# Altium project BigBossBoard.PrjPcb
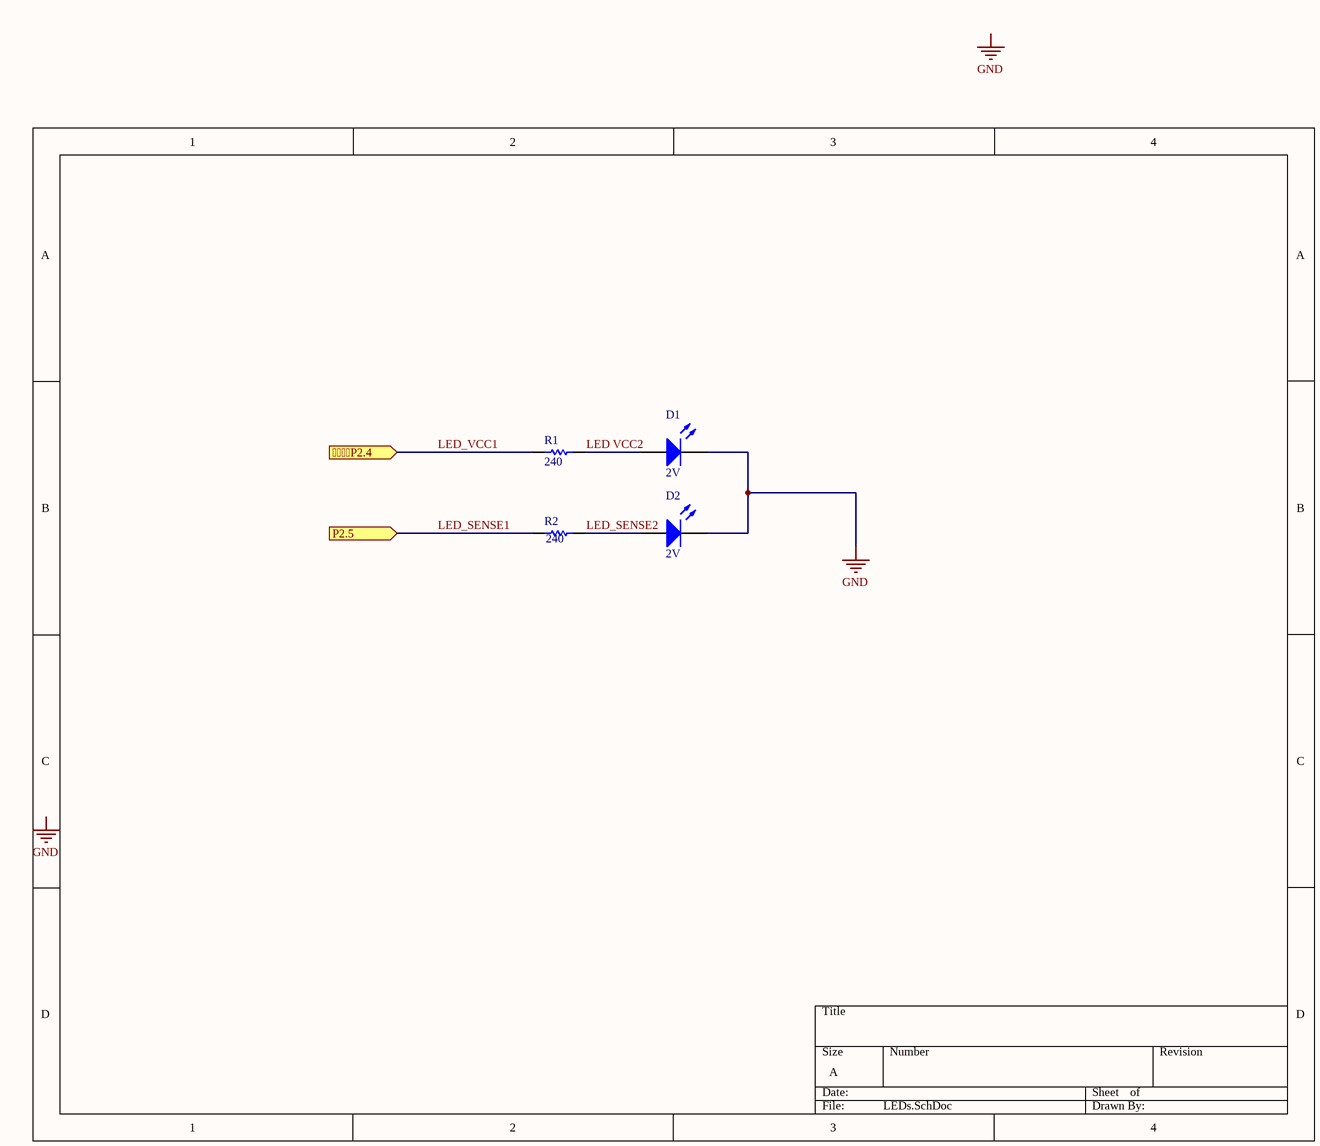
[diagram p0: LEDs.SchDoc]
3 sheets, 9 parts. Net scope: flat (ports and power ports of the same name join across sheets).
Sheets:
  LEDs.SchDoc
  Temperature_Sensor.SchDoc
  Launchpad_Header.SchDoc

## Sheet LEDs.SchDoc
size A; SheetNumber: 1; SheetTotal: 1

### Parts
D1  2V  [0805_A]
D2  2V  [0805_A]
R1  240  [RESC2013X70X40NL20T20]
R2  240  [RESC2013X70X40NL20T20]

### Ports
P2.4 (in), P2.5 (in)

### Nets
GND: D1.1(K) D2.1(K)
LED VCC2: D1.2(A) R1.2
LED_SENSE1: R2.1 ; port P2.5
LED_SENSE2: D2.2(A) R2.2
LED_VCC1: R1.1 ; port P2.4

### Notes on the sheet
- Labels drawn without touching a wire or pin: GND

### Library data of the parts
D1 D2 = CMP-1426-00009-1: SMD mono-color Chip LED, WL-SMCW, Bright Green; PartNumber: 150080VS75000; Manufacturer: Wuerth Elektronik; ComponentLink1Description: Manufacturer URL; Color: Bright Green; PackageReference: 0805_A; ComponentLink1URL: http://www.we-online.com; ComponentLink2Description: Datasheet; ComponentLink2URL: http://katalog.we-online.com/led/datasheet/150080VS75000.pdf
R1 R2 = CMP-2001-00524-1: Part Number: ERJ-6ENF2400V; Manufacturer: Panasonic

## Sheet Temperature_Sensor.SchDoc
size A; SheetNumber: 2; SheetTotal: 2
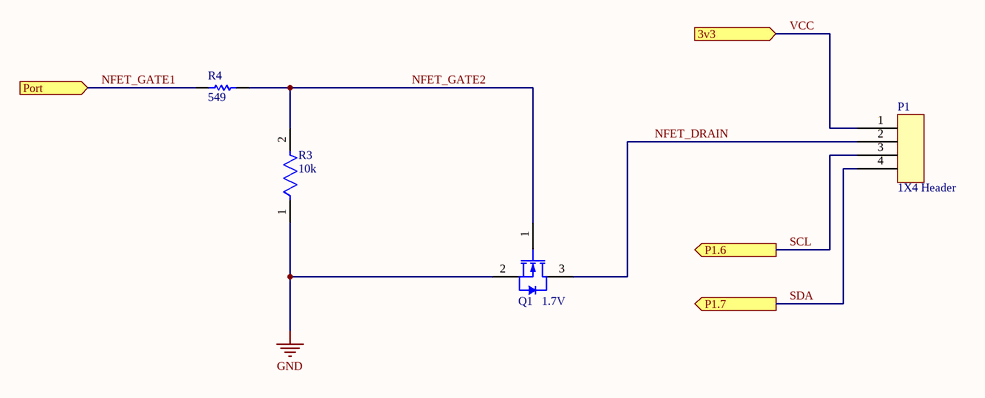
[diagram p1: Temperature_Sensor.SchDoc]

### Parts
P1  1X4 Header  [1X4 HEADER]
Q1_1.7V  (no value)  [FAIR-SOT23-3_V]
R3  10k  [FP-ERJP06-MFG]
R4  549  [RESC2013X70X40LL20T20]

### Ports
3v3 (in), P1.6 (out), P1.7 (out), Port (in)

### Nets
GND: Q1_1.7V.2(S) R3.1
NFET_DRAIN: P1.2 Q1_1.7V.3(D)
NFET_GATE1: R4.1 ; port Port
NFET_GATE2: Q1_1.7V.1(G) R3.2 R4.2
SCL: P1.3 ; port P1.6
SDA: P1.4 ; port P1.7
VCC: P1.1 ; port 3v3

### Library data of the parts
P1 = CMP-004-000002-1: CONN HEADER VERT 4POS 2.54MM; Manufacturer Part Number: 61300411121; Manufacturer: Würth Elektronik; Design Item ID: 1X4 Header; Pin Count: 4; Source: URC.SchLib; Value: 1x4 Header; Component Type: Standard
Q1_1.7V = CMP-013-00021-4: N-Channel Logic Level Enhancement Mode Field Effect Transistor, 220 mA, 50 V, -55 to 150 degC, 3-Pin SOT-23, RoHS, Tape and Reel; Manufacturer: Fairchild; Elements: 1; Nominal Vgs: 1.3V; Resistance: 0.7Ohm; Typical Rise Time: 9ns; Rds On Max: 3.5Ohm; Nominal Dual Supply Voltage: 50V; Input Capacitance: 27pF; Package Version: Rev. 12, 03/2016; Power: 360mW; Packaging: TapeandReel; Package Description: 3-Pin Small Outline Transistor, Body 2.92 x 1.325 mm, Pitch 0.95 mm; Datasheet URL: https://www.fairchildsemi.com/datasheets/BS/BSS138.pdf; Min Operating Temperature: -55°C; Pins: 3; RoHS Compliant: True; Package Reference: SOT23-3; Package Quantity: 1; Case/Package: TO-236-3; Mounting Technology: SM; Max Operating Temperature: 150°C; Datasheet Version: Rev. C, 10/2005
R3 = CMP-05422-000126-1: RES SMD 10K OHM 1% 1/2W 0805; Temperature Coefficient: 100ppm/°C; Resistance: 10kR; Voltage Rating (DC): 150V; Max Power Dissipation: 500mW; Termination: SMD/SMT; Tolerance: 1%; Width: 1.2mm; Case/Package: 0805; Number of Terminations: 2; Resistor Type: Thick Film; Radiation Hardening: No; Resistance Tolerance: 1%; Package Quantity: 5000; Max Operating Temperature: 155°C; RoHS Compliant: Yes; Mount: Surface Mount; Case Code (Imperial): 0805; Construction: Rectangular; Height: 0.6mm; Lead Free: Lead Free; Depth: 1.25mm; Packaging: Tape and Reel; REACH SVHC: No SVHC; Technology: THICK FILM; Features: Automotive AEC-Q200; Contact Plating: Tin; Voltage Rating: 150V; Military Standard: Not; Power Rating: 500mW; Case Code (Metric): 2012; Length: 2mm; Min Operating Temperature: -55°C; Series: ERJ
R4 = CMP-2001-00231-1: Part Number: ERJ-6ENF5490V; Manufacturer: Panasonic

## Sheet Launchpad_Header.SchDoc
size A; SheetNumber: 3; SheetTotal: 3
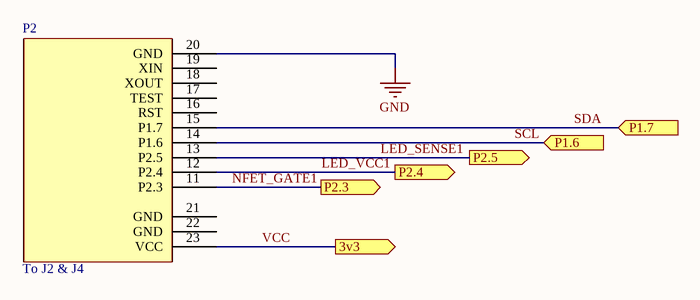
[diagram p2: Launchpad_Header.SchDoc]

### Parts
P2  To J2 & J4  [MSP-EXP430G2 Mating Headers for J2/J4]

### Ports
3v3 (out, see Temperature_Sensor[3B]), P1.6 (in, see Temperature_Sensor[3C]), P1.7 (in, see Temperature_Sensor[3C]), P2.3 (out), P2.4 (out), P2.5 (out, see LEDs[1B])

### Nets
GND: P2.20(GND)
LED_SENSE1: P2.13(P2.5) ; port P2.5
LED_VCC1: P2.12(P2.4) ; port P2.4
NFET_GATE1: P2.11(P2.3) ; port P2.3
SCL: P2.14(P1.6) ; port P1.6
SDA: P2.15(P1.7) ; port P1.7
VCC: P2.23(VCC) ; port 3v3

Not connected (* = marked no-connect by the designer): P2 16(RST) 17(TEST) 18(XOUT) 19(XIN) 21(GND) 22(GND)

### Library data of the parts
P2 = CMP-004-000015-1: Female Mating Headers for MSP-EXP430G2 J2 & J4 / (can use Würth Elektronik 61301011121 and 61300311121); Manufacturer: URC; Pin Count: 13; Component Type: Standard; Manufacturer Part Number: N/A; Value: N/A; Source: URC.SchLib; Design Item ID: MSP-EXP430G2 Mating Headers for J2/J4

## Nets that join several sheets
GND: LEDs (D1.1 D2.1), Temperature_Sensor (Q1_1.7V.2 R3.1), Launchpad_Header (P2.20)
LED_SENSE1: LEDs (R2.1), Launchpad_Header (P2.13)
SCL: Temperature_Sensor (P1.3), Launchpad_Header (P2.14)
SDA: Temperature_Sensor (P1.4), Launchpad_Header (P2.15)
VCC: Temperature_Sensor (P1.1), Launchpad_Header (P2.23)